# EAGLE design PillEndo-MkI_CAM4 (EAGLE 6.5.0)
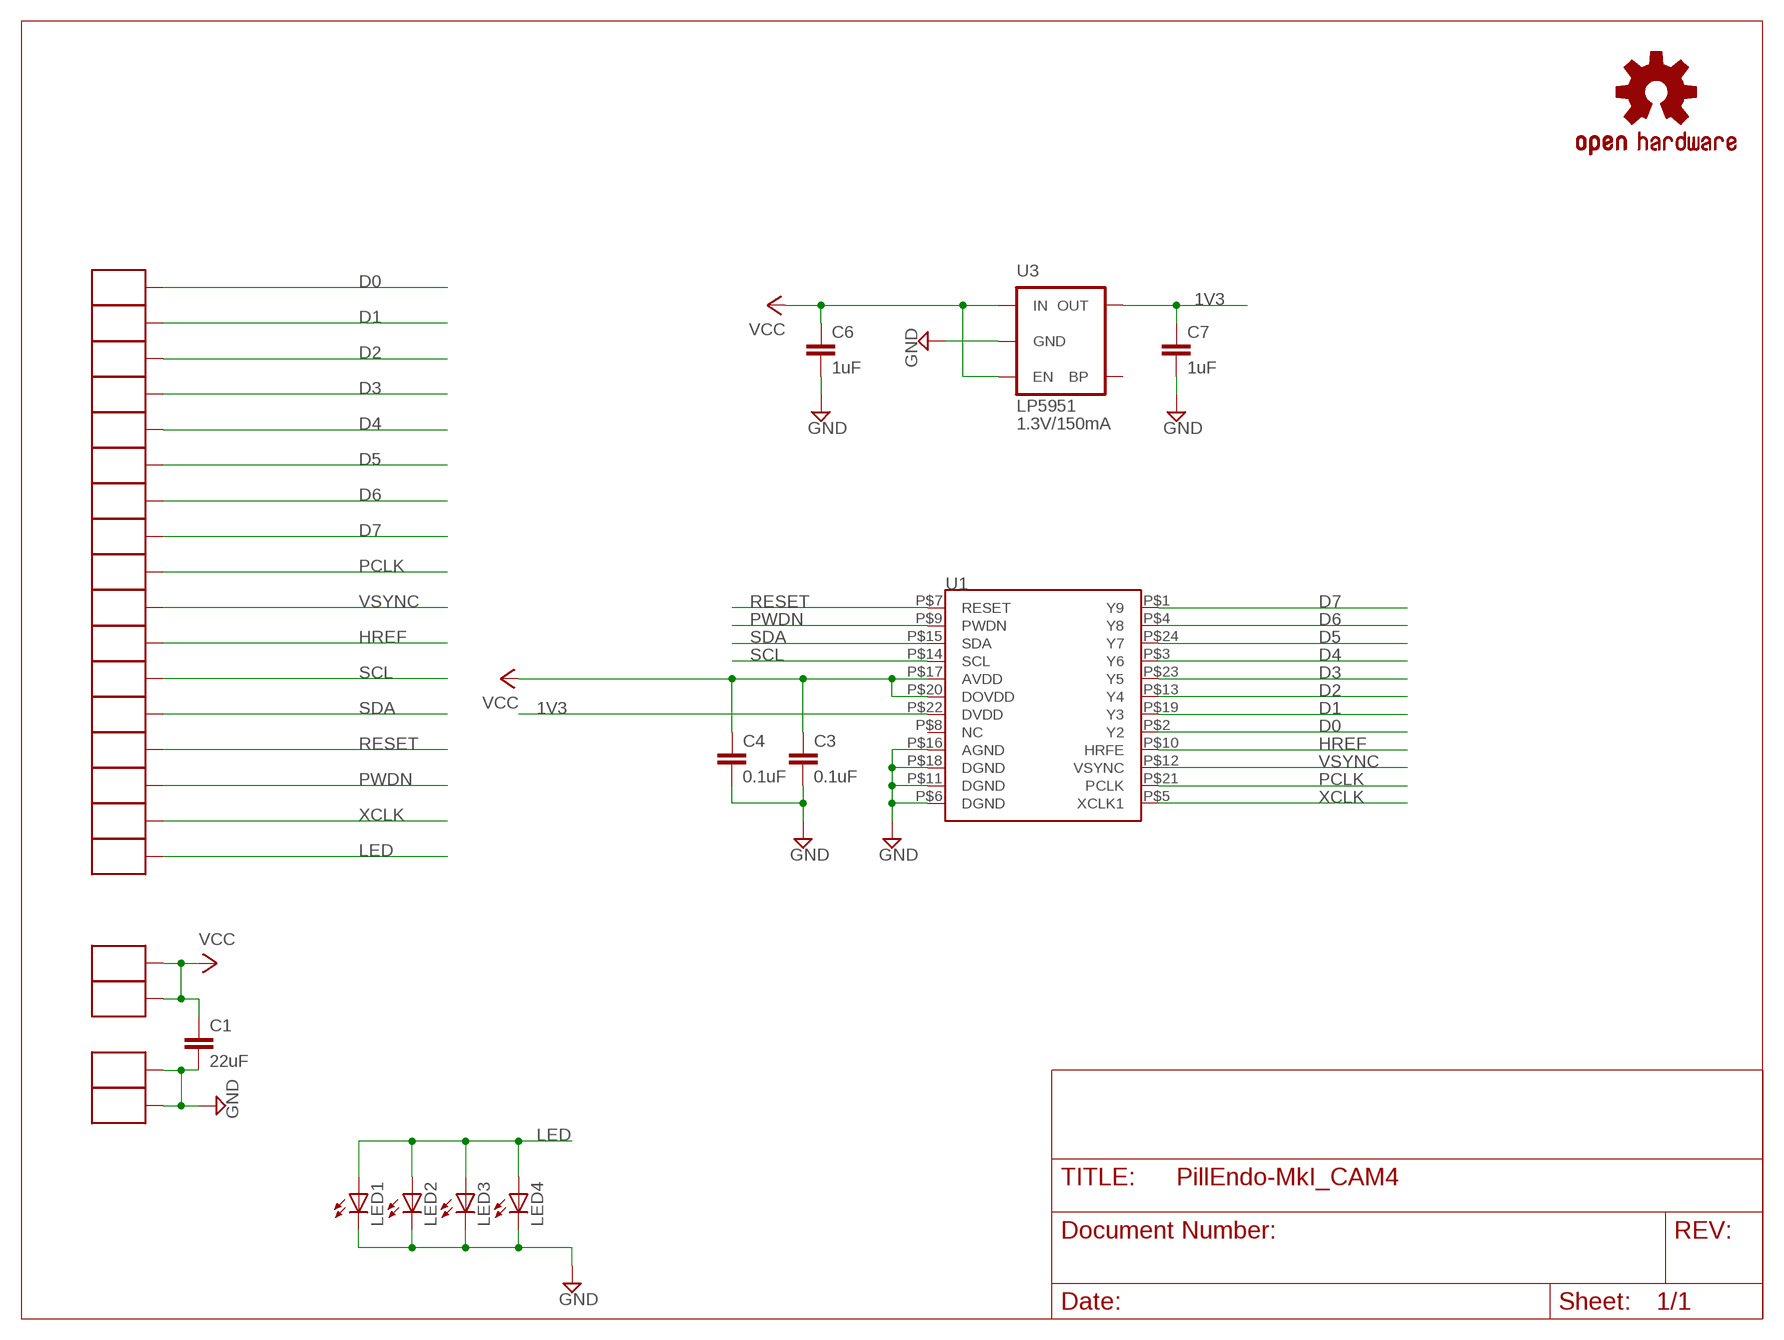
[diagram p0: schematic, sheet 1]

## Parts
C1  22uF  C0603  [C0603]
C3  0.1uF  C-EUC0201  [C0201]
C4  0.1uF  C-EUC0201  [C0201]
C6  1uF  C-EUC0402  [C0402]
C7  1uF  C-EUC0402  [C0402]
LED1  LED  [SMARTLED-TTW]
LED2  LED  [SMARTLED-TTW]
LED3  LED  [SMARTLED-TTW]
LED4  LED  [SMARTLED-TTW]
LOGO1  OSHW-LOGOS  [OSHW-LOGO-S]
TP1  TP_0.8X0.8  [TP_0.8X0.8]
TP2  TP_0.8X0.8  [TP_0.8X0.8]
TP3  TP_0.8X0.8  [TP_0.8X0.8]
TP4  TP_0.8X0.8  [TP_0.8X0.8]
TP5  TP_0.8X0.8  [TP_0.8X0.8]
TP6  TP_0.8X0.8  [TP_0.8X0.8]
TP7  TP_0.8X0.8  [TP_0.8X0.8]
TP8  TP_0.8X0.8  [TP_0.8X0.8]
TP9  TP_0.8X0.8  [TP_0.8X0.8]
TP10  TP_0.8X0.8  [TP_0.8X0.8]
TP11  TP_0.8X0.8  [TP_0.8X0.8]
TP12  TP_0.8X0.8  [TP_0.8X0.8]
TP13  TP_0.8X0.8  [TP_0.8X0.8]
TP14  TP_0.8X0.8  [TP_0.8X0.8]
TP15  TP_0.8X0.8  [TP_0.8X0.8]
TP16  TP_0.8X0.8  [TP_0.8X0.8]
TP17  TP_0.8X0.8  [TP_0.8X0.8]
TP18  TP_1.0X1.2  [TP_1.0X1.2]
TP19  TP_1.0X1.2  [TP_1.0X1.2]
TP20  TP_1.0X1.2  [TP_1.0X1.2]
TP21  TP_1.0X1.2  [TP_1.0X1.2]
U1  UC2640B  [UC2640B]
U3  1.8V/100mA  V_REG_SP62141.8V  [SC70]

## Nets
1V3: C7.1 U1.P$22(DVDD) U3.5(OUT)
D0: TP11.P$1 U1.P$2(Y2)
D1: TP1.P$1 U1.P$19(Y3)
D2: TP9.P$1 U1.P$13(Y4)
D3: TP3.P$1 U1.P$23(Y5)
D4: TP12.P$1 U1.P$3(Y6)
D5: TP4.P$1 U1.P$24(Y7)
D6: TP13.P$1 U1.P$4(Y8)
D7: TP10.P$1 U1.P$1(Y9)
GND: C1.2 C3.2 C4.2 C6.2 C7.2 LED1.C@1(C) LED2.C@1(C) LED3.C@1(C) LED4.C@1(C) TP18.P$1 TP19.P$1 U1.P$6(DGND) U1.P$11(DGND) U1.P$16(AGND) U1.P$18(DGND) U3.2(GND)
HREF: TP5.P$1 U1.P$10(HRFE)
LED: LED1.A@1(A) LED2.A@1(A) LED3.A@1(A) LED4.A@1(A) TP14.P$1
PCLK: TP2.P$1 U1.P$21(PCLK)
PWDN: TP15.P$1 U1.P$9(PWDN)
RESET: TP17.P$1 U1.P$7(RESET)
SCL: TP8.P$1 U1.P$14(SCL)
SDA: TP7.P$1 U1.P$15(SDA)
VCC: C1.1 C3.1 C4.1 C6.1 TP20.P$1 TP21.P$1 U1.P$17(AVDD) U1.P$20(DOVDD) U3.1(IN) U3.3(EN)
VSYNC: TP6.P$1 U1.P$12(VSYNC)
XCLK: TP16.P$1 U1.P$5(XCLK1)
Unconnected: U1.P$8(NC) U3.4(BP)

## Notes on the sheet
- LP5951
- 1.3V/150mA

## Library data of the parts
C1 = MSSRP-Lib:C0603
C3 C4 C6 C7 = rcl:C-EU: CAPACITOR, European symbol
LED1-LED4 = adafruit:LED: LED OSRAM: - CHIPLED LG R971, LG N971, LY N971, LG Q971, LY Q971, LO R971, LY R971 LH N974, LH R974 LS Q976, LO Q976, LY Q976 LO Q996 - Hyper CHIPLED LW Q18S LB Q993, LB Q99A, LB R99A - SideLED LS A670, LO A670, LY A670, LG A670, LP A670 LB A673, LV A673, LT A673, LW A673 LH A674 LY A675 LS A676, LA A676, LO A676, LY A676, LW A676 LS A679, LY A679, LG A679 - Hyper Micro SIDELED® LS Y876, LA Y876, LO Y876, LY Y876 LT Y87S - SmartLED LW L88C, LW L88S LB L89C, LB L89S, LG L890 LS L89K, LO L89K, LY L89K LS L896, LA L896, LO L896, LY L896 - TOPLED LS T670, LO T670, LY T670, LG T670, LP T670 LSG T670, LSP T670, LSY T670, LOP T670, LYG T670 LG T671, LOG T671, LSG T671 LB T673, LV T673, LT T673, LW T673 LH T674 LS T676, LA T676, LO T676, LY T676, LB T676, LH T676, LSB T676, LW T676 LB T67C, LV T67C, LT T67C, LS T67K, LO T67K, LY T67K, LW E67C LS E67B, LA E67B, LO E67B, LY E67B, LB E67C, LV E67C, LT E67C LW T67C LS T679, LY T679, LG T679 LS T770, LO T770, LY T770, LG T770, LP T770 LB T773, LV T773, LT T773, LW T773 LH T774 LS E675, LA E675, LY E675, LS T675 LS T776, LA T776, LO T776, LY T776, LB T776 LHGB T686 LT T68C, LB T68C - Hyper Mini TOPLED® LB M676 - Mini TOPLED Santana® LG M470 LS M47K, LO M47K, LY M47K Source: http://www.osram.convergy.de/
LOGO1 = SparkFun-Aesthetics:OSHW-LOGO: Open Source Hardware Logo This logo indicates the piece of hardware it is found on incorporates a OSHW license and/or adheres to the definition of open source hardware found here: http://freedomdefined.org/OSHW
TP1-TP21 = MSSRP-Lib:TP
U1 = MSSRP-Lib:UC2640B
U3 = SparkFun-PowerIC:V_REG_SP6214; PROD_ID: VREG-08428

## Board
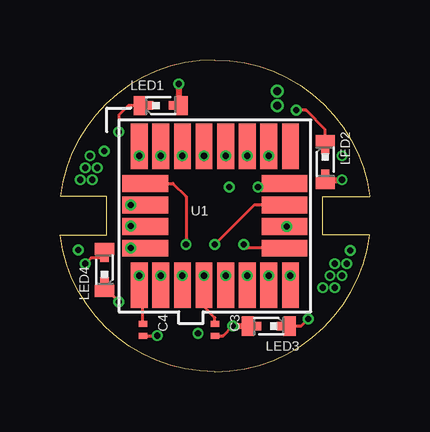
[diagram p1: board, top side]
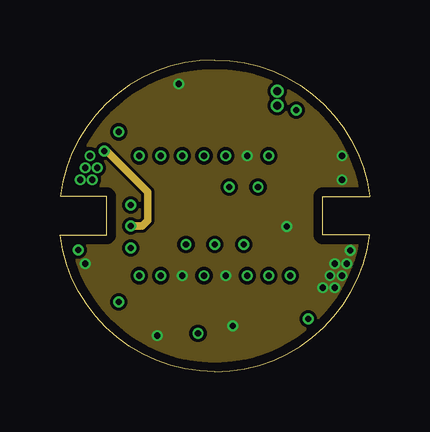
[diagram p2: board, inner layer Route2]
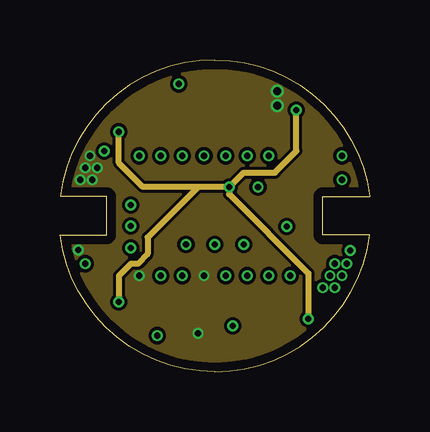
[diagram p3: board, inner layer Route15]
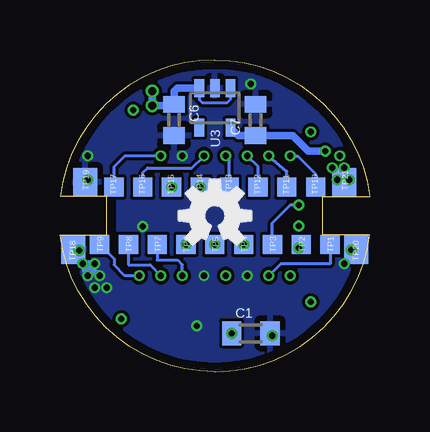
[diagram p4: board, bottom side, seen from below]

Size 12.9 x 13 mm. Coordinates in mm from the lower left corner, seen from the top.
Outline: 12.9,5.7 10.95,5.7 10.95,7.3 12.9,7.3 arc83 6.45,13 arc83 0,7.3 1.95,7.3 1.95,5.7 0,5.7 arc83 6.45,0 arc83 12.9,5.7
Copper layers (1*2*15*16): Top 0.035559375mm / dielectric 0.17018125mm / Route2 0.01778125mm / dielectric 47mil / Route15 0.01778125mm / dielectric 0.17018125mm / Bottom 0.035559375mm
Design rules "OSHPark-4layer": minimum track width 5mil, minimum drill 10mil, track to track 5mil, track to pad 5mil, pad to pad 5mil, via to via 5mil, smd to smd 5mil, copper to edge 15mil, drill to drill 6mil, minimum pad ring 4mil, minimum via ring 4mil, stop-mask expansion 4mil, vias tented up to drill 0mil, thermal gap 10mil

### Footprints (pad centres in the part's own frame; a part is rotated, then mirrored left to right if it is on the bottom)
C0603 = smd 0.8 x 1: 1 -0.8,0; 2 0.8,0
C0201 = smd 0.25 x 0.35: 1 -0.25,0; 2 0.25,0
C0402 = smd 0.7 x 0.9: 1 -0.65,0; 2 0.65,0
SMARTLED-TTW = smd 0.8 x 0.5: A 0,-0.875; C 0,0.875 | smd 0.35 x 0.35: A@1 0,-0.5; C@1 0,0.5
TP_0.8X0.8 = smd 0.8 x 0.8: P$1 -0.4,0
TP_1.0X1.2 = smd 1.2 x 1: P$1 -0.6,0
UC2640B = smd 0.7 x 1.9: P$1 -3.15,2.9; P$2 -2.25,2.9; P$3 -1.35,2.9; P$4 -0.45,2.9; P$5 0.45,2.9; P$6 1.35,2.9; P$7 2.25,2.9; P$8 3.15,2.9; P$13 3.15,-2.9; P$14 2.25,-2.9; P$15 1.35,-2.9; P$16 0.45,-2.9; P$17 -0.45,-2.9; P$18 -1.35,-2.9; P$19 -2.25,-2.9; P$20 -3.15,-2.9 | smd 1.9 x 0.7: P$9 2.9,1.35; P$10 2.9,0.45; P$11 2.9,-0.45; P$12 2.9,-1.35; P$21 -2.9,-1.35; P$22 -2.9,-0.45; P$23 -2.9,0.45; P$24 -2.9,1.35
SC70 = smd 0.4 x 0.75: 1 -0.65,-0.825; 2 0,-0.825; 3 0.65,-0.825; 4 0.65,0.825; 5 -0.65,0.825

### Placement (x,y rotation side)
C1  4.95,1.6 0 bottom
C3  6.45,1.75 270 top
C4  3.45,1.75 270 top
C6  8.15,10.5 270 bottom
C7  4.75,10.5 90 bottom
LED1  4.2,11.1 270 top
LED2  11.05,8.75 180 top
LED3  8.7,1.9 90 top
LED4  1.85,4.25 0 top
LOGO1  6.45,6.5 0 bottom
TP1  1.65,5.7 90 bottom
TP2  2.85,5.7 90 bottom
TP3  4.05,5.7 90 bottom
TP4  5.25,5.7 90 bottom
TP5  6.45,5.7 90 bottom
TP6  7.65,5.7 90 bottom
TP7  8.85,5.7 90 bottom
TP8  10.05,5.7 90 bottom
TP9  11.25,5.7 90 bottom
TP10  2.25,7.3 270 bottom
TP11  3.45,7.3 270 bottom
TP12  4.65,7.3 270 bottom
TP13  5.85,7.3 270 bottom
TP14  7.05,7.3 270 bottom
TP15  8.25,7.3 270 bottom
TP16  9.45,7.3 270 bottom
TP17  10.65,7.3 270 bottom
TP18  12.35,5.7 90 bottom
TP19  11.85,7.3 270 bottom
TP20  0.55,5.7 90 bottom
TP21  1.05,7.3 270 bottom
U1  6.45,6.5 0 top
U3  6.45,11 180 bottom

### Tracks (layer width: path | path; a pad name or v marks a point on that pad's centre or on a via)
1V3  (via drill 0.25)
  Top 0.127: v2.95,6.07 U1.P$22
  Route2 0.305: v2.95,6.07 3.42,6.07 3.65,6.3 3.65,7.5 1.95,9.2 v1.85,9.2
  Bottom 0.305: U3.5 5.48,9.85 C7.1 3.2,9.85 2.55,9.2 v1.85,9.2
D0  (via drill 0.25)
  Top 0.127: U1.P$2 v4.2,9
  Bottom 0.127: TP11.P$1 3.45,8.35 v4.2,9
D1  (via drill 0.25)
  Top 0.127: v4.2,4 U1.P$19
  Bottom 0.127: TP1.P$1 1.65,4.5 3.7,4.5 v4.2,4
D2  (via drill 0.25)
  Top 0.127: v9.6,4 U1.P$13
  Bottom 0.127: TP9.P$1 10.65,4.7 10.65,4.45 10.2,4 v9.6,4
D3  (via drill 0.25)
  Top 0.127: v2.95,6.95 3.5,6.9 U1.P$23
  Bottom 0.127: TP3.P$1 4.05,6.2 3.3,6.95 v2.95,6.95
D4  (via drill 0.25)
  Top 0.127: U1.P$3 v5.1,9
  Bottom 0.127: TP12.P$1 4.65,8.55 v5.1,9
D5  (via drill 0.25)
  Top 0.127: U1.P$24 4.7,7.85 5.25,7.3 TP4.P$1
  other vias: 5.25,5.3
D6  (via drill 0.25)
  Top 0.127: U1.P$4 v6,9
  Bottom 0.127: TP13.P$1 5.85,8.85 v6,9
D7  (via drill 0.25)
  Top 0.127: U1.P$1 v3.3,9
  Bottom 0.127: TP10.P$1 2.25,8.25 3,9 v3.3,9
GND  (via drill 0.25)
  Top 0.127: v5.1,4 U1.P$18 | v6.9,4 U1.P$16 | v7.8,9 U1.P$6 | C4.2 v4.05,1.5 | C3.2 6.8,1.5 v7.2,1.9 | U1.P$11 v9.45,6.05 | LED4.C@1 1.3,4.75 v1.05,4.5
  Top 0.254: v7.2,1.9 LED3.C@1 | v4.95,12 4.95,11.25 LED1.C@1 | LED2.C@1 11.05,8 v11.75,8
  Bottom 0.127: v11.95,4.5 11.95,4.7 TP18.P$1
  Bottom 0.305: v11.95,4.5 v11.45,4.5 | v11.75,4 v11.95,4.5 | v11.25,4 v11.95,4.5
  other vias: 10.95,3.5 11.45,3.5 11.75,9 12.1,5.05
  pour Bottom (rank 6): -0.05,0 12.95,0 12.95,13 -0.05,13
  pour Route2 (isolate 0.127, rank 6): -0.05,0 12.95,0 12.95,13 -0.05,13
HREF  (via drill 0.25)
  Top 0.127: U1.P$10 8.1,6.95 TP5.P$1
  other vias: 6.45,5.3
LED  (via drill 0.25)
  Top 0.127: LED4.A@1 1.85,3.6 v2.45,2.9 | LED1.A@1 2.85,11.1 2.45,10.7 v2.45,10 | LED2.A@1 11.05,10.1 10.25,10.9 v9.85,10.9 | LED3.A@1 10.05,1.9 v10.35,2.2
  Route15 0.254: TP14.P$1 5.75,7.7 | 5.75,7.7 3.65,5.6 3.65,4.9 3.25,4.5 2.95,4.5 2.45,4 v2.45,2.9 | 5.75,7.7 3.45,7.7 2.45,8.7 v2.45,10 | TP14.P$1 7.65,8.3 8.95,8.3 9.85,9.2 v9.85,10.9 | TP14.P$1 7.05,7.4 10.35,4.1 v10.35,2.2
  other vias: 7.05,7.7
PCLK  (via drill 0.25)
  Top 0.127: U1.P$21 v2.95,5.15 TP2.P$1
  Bottom 0.127: TP2.P$1 v2.95,5.15
PWDN  (via drill 0.25)
  Top 0.127: U1.P$9 TP15.P$1
  other vias: 8.25,7.7
RESET  (via drill 0.25)
  Top 0.127: v8.7,9 U1.P$7
  Bottom 0.127: TP17.P$1 10.65,8.55 10.2,9 v8.7,9
SCL  (via drill 0.25)
  Top 0.127: v8.7,4 U1.P$14
  Bottom 0.127: TP8.P$1 10.05,4.45 9.15,4.45 v8.7,4
SDA  (via drill 0.25)
  Top 0.127: v7.8,4 U1.P$15
  Bottom 0.127: TP7.P$1 8.85,4.65 8,4.65 7.8,4.45 v7.8,4
VCC  (via drill 0.25, 0.33)
  Top 0.127: C4.1 3.45,2.95 v3.3,4 U1.P$20 | C3.1 6.45,2.25 6,2.7 v6,4 U1.P$17
  Bottom 0.127: U3.1 5.8,11.35 5.95,11.2 6.95,11.2 7.1,11.35 U3.3 | TP20.P$1 0.73,5.1 v0.76,5.07 | TP21.P$1 1.25,7.9 v1.35,8
  Bottom 0.305: U3.3 8.02,11.82 8.15,11.7 C6.1 8.2,11.1 v9.05,11.1 v9.05,11.7
  other vias: 1.25,9 1.05,8.5 1.55,8.5 0.85,8 5.75,1.6
  pour Route15 (isolate 0.127, rank 6): -0.05,0 12.95,0 12.95,13 -0.05,13
VSYNC  (via drill 0.25)
  Top 0.127: U1.P$12 7.8,5.15 TP6.P$1
  other vias: 7.65,5.3
XCLK  (via drill 0.25)
  Top 0.127: U1.P$5 v6.9,9
  Bottom 0.127: TP16.P$1 9.45,8.3 9.25,8.5 7.4,8.5 v6.9,9